# EAGLE design satshakit_micro (EAGLE 7.5.0)
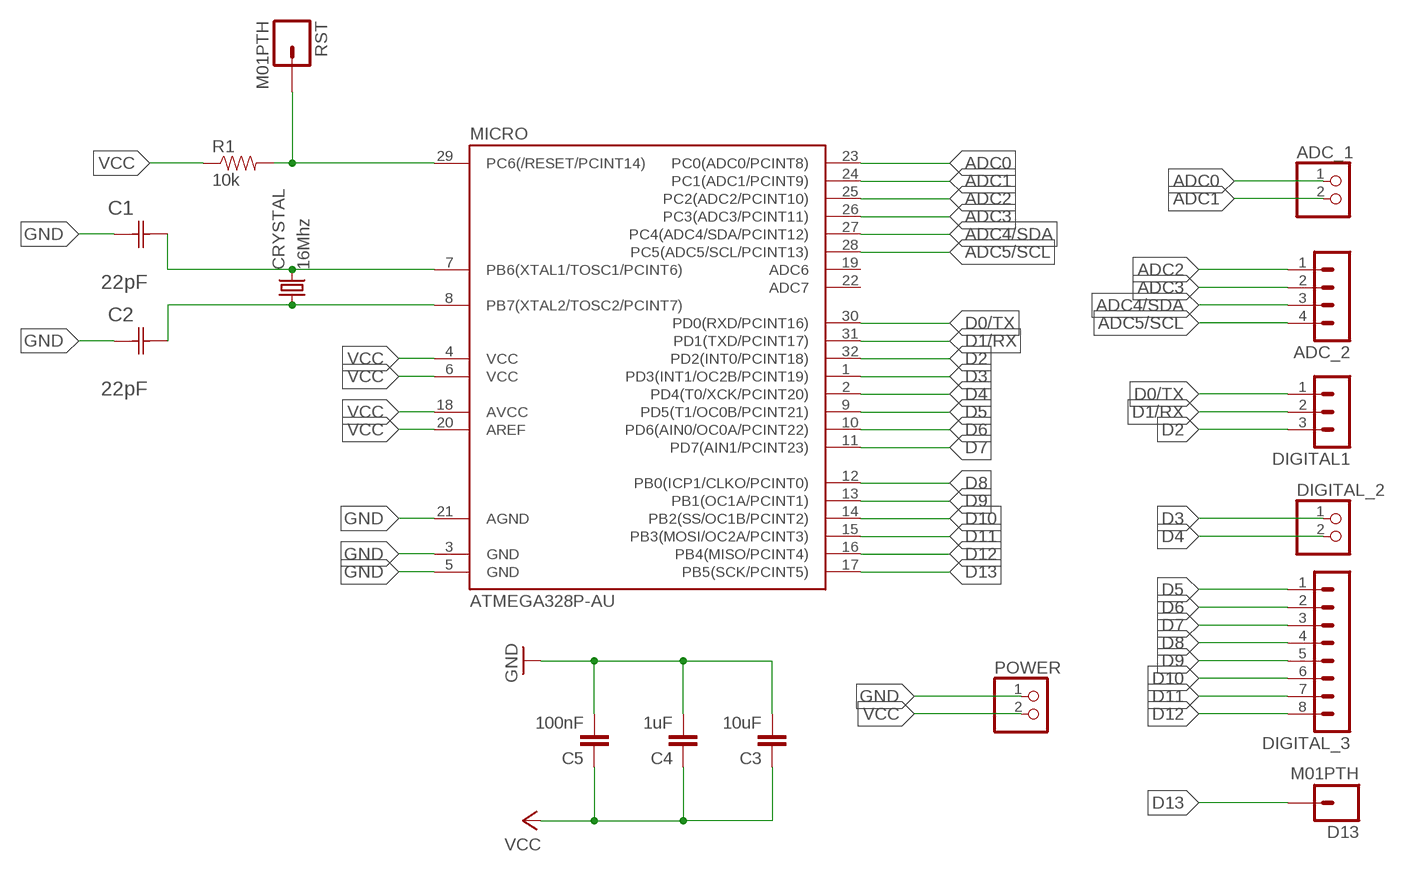
[diagram p0: schematic, sheet 1]

## Parts
ADC_1  PINHD-1X2  [1X02]
ADC_2  MA04-1  [MA04-1]
C1  22pF  0612ZC225MAT2A  [CAPC3216X178N]
C2  22pF  0612ZC225MAT2A  [CAPC3216X178N]
C3  10uF  CAP1206  [1206]
C4  1uF  CAP1206  [1206]
C5  100nF  CAP1206  [1206]
CRYSTAL  16Mhz  CSM-7X-DU  [CSM-7X-DU]
D13  M01PTH  [1X01]
DIGITAL1  MA03-1  [MA03-1]
DIGITAL_2  PINHD-1X2  [1X02]
DIGITAL_3  MA08-1  [MA08-1]
MICRO  ATMEGA328P-AU  ATMEGA48/88/168-AU  [TQFP32-08]
POWER  PINHD-1X2  [1X02]
R1  10k  RESISTOR1206  [1206]
RST  M01PTH  [1X01]

## Nets
ADC0: ADC_1.1 MICRO.23(PC0(ADC0/PCINT8))
ADC1: ADC_1.2 MICRO.24(PC1(ADC1/PCINT9))
ADC2: ADC_2.1 MICRO.25(PC2(ADC2/PCINT10))
ADC3: ADC_2.2 MICRO.26(PC3(ADC3/PCINT11))
ADC4/SDA: ADC_2.3 MICRO.27(PC4(ADC4/SDA/PCINT12))
ADC5/SCL: ADC_2.4 MICRO.28(PC5(ADC5/SCL/PCINT13))
D0/TX: DIGITAL1.1 MICRO.30(PD0(RXD/PCINT16))
D1/RX: DIGITAL1.2 MICRO.31(PD1(TXD/PCINT17))
D2: DIGITAL1.3 MICRO.32(PD2(INT0/PCINT18))
D3: DIGITAL_2.1 MICRO.1(PD3(INT1/OC2B/PCINT19))
D4: DIGITAL_2.2 MICRO.2(PD4(T0/XCK/PCINT20))
D5: DIGITAL_3.1 MICRO.9(PD5(T1/OC0B/PCINT21))
D6: DIGITAL_3.2 MICRO.10(PD6(AIN0/OC0A/PCINT22))
D7: DIGITAL_3.3 MICRO.11(PD7(AIN1/PCINT23))
D8: DIGITAL_3.4 MICRO.12(PB0(ICP1/CLKO/PCINT0))
D9: DIGITAL_3.5 MICRO.13(PB1(OC1A/PCINT1))
D10: DIGITAL_3.6 MICRO.14(PB2(SS/OC1B/PCINT2))
D11: DIGITAL_3.7 MICRO.15(PB3(MOSI/OC2A/PCINT3))
D12: DIGITAL_3.8 MICRO.16(PB4(MISO/PCINT4))
D13: D13.1 MICRO.17(PB5(SCK/PCINT5))
GND: C1.1(C1) C2.1(C1) C3.2 C4.2 C5.2 MICRO.3(GND) MICRO.5(GND) MICRO.21(AGND) POWER.1
N$2: C1.2(C2) CRYSTAL.2 MICRO.7(PB6(XTAL1/TOSC1/PCINT6))
N$3: MICRO.29(PC6(/RESET/PCINT14)) R1.2 RST.1
N$9: C2.2(C2) CRYSTAL.1 MICRO.8(PB7(XTAL2/TOSC2/PCINT7))
VCC: C3.1 C4.1 C5.1 MICRO.4(VCC) MICRO.6(VCC) MICRO.18(AVCC) MICRO.20(AREF) POWER.2 R1.1
Unconnected: MICRO.19(ADC6) MICRO.22(ADC7)

## Library data of the parts
ADC_1 DIGITAL_2 POWER = pinhead:PINHD-1X2: PIN HEADER
ADC_2 = con-lstb:MA04-1: PIN HEADER; OC_FARNELL: unknown; OC_NEWARK: unknown
C1 C2 = AVX_By_element14_Batch_1:0612ZC225MAT2A: Capacitor 1206; MPN: 0612ZC225MAT2A; OC_FARNELL: -; OC_NEWARK: 12N3209; SUPPLIER: AVX; TOLERANCE: ±20%; VALUE: 2.2µF; VOLTAGERATING: 10V
C3-C5 = 01_SparkFun:CAP: Capacitor Standard 0603 ceramic capacitor, and 0.1" leaded capacitor.
CRYSTAL = 01_FAB_Hello:CSM-7X-DU: SMD CRYSTAL Source: www.ecsxtal.com .. Crystal 3.6864MHz CSM_7X_DU.PDF; OC_FARNELL: unknown; OC_NEWARK: unknown
D13 RST = 01_SparkFun:M01: Header 1 Standard 1-pin 0.1" header. Use with straight break away headers (SKU : PRT-00116), right angle break away headers (PRT-00553), swiss pins (PRT-00743), machine pins (PRT-00117), and female headers (PRT-00115).
DIGITAL1 = con-lstb:MA03-1: PIN HEADER; OC_FARNELL: unknown; OC_NEWARK: unknown
DIGITAL_3 = con-lstb:MA08-1: PIN HEADER; OC_FARNELL: unknown; OC_NEWARK: unknown
MICRO = atmega8:ATMEGA48/88/168
R1 = 01_SparkFun:RESISTOR: Resistor Basic schematic elements and footprints for 0603, 1206, and PTH 1/10th watt (small) resistors.

## Board
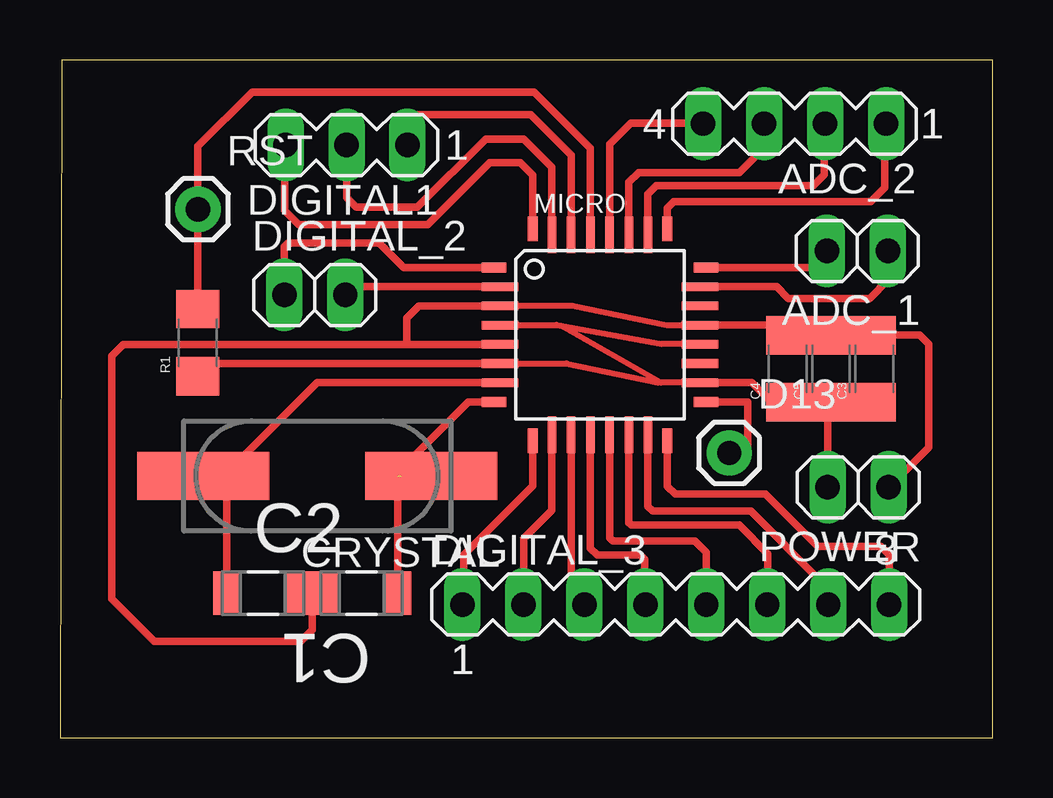
[diagram p1: board, top side]

Size 38.86 x 28.26 mm. Coordinates in mm from the lower left corner, seen from the top.
Outline: 0,0 38.86,0 38.86,28.26 0.08,28.26 0,0
Copper layers (1*16): Top 0.035mm / dielectric 1.5mm / Bottom 0.035mm
Design rules "default": minimum track width 10mil, minimum drill 24mil, track to track 8mil, track to pad 8mil, pad to pad 8mil, via to via 8mil, smd to smd 8mil, copper to edge 40mil, drill to drill 8mil, minimum pad ring 10mil, minimum via ring 8mil, stop-mask expansion 4mil, vias tented up to drill 0mil, thermal gap 10mil

### Footprints (pad centres in the part's own frame; a part is rotated, then mirrored left to right if it is on the bottom)
1X02 = drill 1.016 long: 1 -1.27,0; 2 1.27,0
MA04-1 = drill 1.016 long: 1 -3.81,0; 2 -1.27,0; 3 1.27,0; 4 3.81,0
CAPC3216X178N = smd 1.118 x 1.803: 1 -1.499,0; 2 1.499,0
1206 = smd 1.6 x 1.8: 1 -1.4,0; 2 1.4,0
CSM-7X-DU = smd 5.5 x 2: 1 -4.75,0; 2 4.75,0
1X01 = drill 1.016 pad 1.88: 1 0,0
MA03-1 = drill 1.016 long: 1 -2.54,0; 2 0,0; 3 2.54,0
MA08-1 = drill 1.016 long: 1 -8.89,0; 2 -6.35,0; 3 -3.81,0; 4 -1.27,0; 5 1.27,0; 6 3.81,0; 7 6.35,0; 8 8.89,0
TQFP32-08 = smd 1.016 x 0.406: 1 -4.42,2.8; 8 -4.42,-2.8; 17 4.42,-2.8; 24 4.42,2.8 | smd 1.524 x 0.356: 2 -4.166,2; 3 -4.166,1.2; 4 -4.166,0.4; 5 -4.166,-0.4; 6 -4.166,-1.2; 7 -4.166,-2; 18 4.166,-2; 19 4.166,-1.2; 20 4.166,-0.4; 21 4.166,0.4; 22 4.166,1.2; 23 4.166,2 | smd 0.406 x 1.016: 9 -2.8,-4.42; 16 2.8,-4.42; 25 2.8,4.42; 32 -2.8,4.42 | smd 0.356 x 1.524: 10 -2,-4.166; 11 -1.2,-4.166; 12 -0.4,-4.166; 13 0.4,-4.166; 14 1.2,-4.166; 15 2,-4.166; 26 2,4.166; 27 1.2,4.166; 28 0.4,4.166; 29 -0.4,4.166; 30 -1.2,4.166; 31 -2,4.166

### Placement (x,y rotation side)
ADC_1  33.22,20.29 180 top
ADC_2  30.61,25.6 180 top
C1  8.45,6.04 180 top
C2  12.57,6.04 0 top
C3  33.93,15.38 90 top
C4  30.32,15.38 90 top
C5  32.13,15.38 90 top
CRYSTAL  10.71,10.91 180 top
D13  27.88,11.88 0 top
DIGITAL1  11.94,24.71 180 top
DIGITAL_2  10.62,18.47 0 top
DIGITAL_3  25.66,5.56 0 top
MICRO  22.5,16.8 0 top
POWER  33.25,10.44 180 top
R1  5.74,16.47 90 top
RST  5.75,22.03 0 top

### Tracks (layer width: path | path; a pad name or v marks a point on that pad's centre or on a via)
ADC0
  Top 0.305: MICRO.23 29.86,18.8 30.35,18.31 33.73,18.31 34.49,19.08 ADC_1.1
ADC1
  Top 0.305: MICRO.24 31.95,19.61 ADC_1.2
ADC2
  Top 0.305: MICRO.25 25.3,22.07 25.58,22.35 33.78,22.35 34.37,22.94 34.37,25.55 ADC_2.1
ADC3
  Top 0.305: MICRO.26 24.5,22.67 24.84,23.01 31.39,23.01 31.85,23.47 31.85,25.58 ADC_2.2
ADC4/SDA
  Top 0.305: MICRO.27 23.7,23.17 24.11,23.57 28.3,23.57 29.34,24.61 ADC_2.3
ADC5/SCL
  Top 0.305: MICRO.28 22.9,24.75 23.77,25.63 26.77,25.63 ADC_2.4
D0/TX
  Top 0.305: MICRO.30 21.3,24.29 19.61,25.98 14.48,25.98 DIGITAL1.1
D1/RX
  Top 0.305: MICRO.31 20.5,23.8 19.33,24.97 17.73,24.97 14.88,22.12 12.34,22.12 11.94,22.53 DIGITAL1.2
D2
  Top 0.305: MICRO.32 19.7,23.46 19.18,23.98 17.91,23.98 15.32,21.39 9.96,21.39 9.37,21.97 9.37,24.69 DIGITAL1.3
D3
  Top 0.305: MICRO.1 14.33,19.61 13.31,20.62 9.5,20.62 9.35,20.47 DIGITAL_2.1
D4
  Top 0.305: MICRO.2 12.23,18.8 DIGITAL_2.2
D5
  Top 0.305: MICRO.9 19.7,10.5 16.81,7.62 16.81,5.6 DIGITAL_3.1
D6
  Top 0.305: MICRO.10 20.5,9.48 19.33,8.31 19.33,5.58 DIGITAL_3.2
D7
  Top 0.305: MICRO.11 21.3,6.11 DIGITAL_3.3
D8
  Top 0.305: MICRO.12 22.1,7.9 22.38,7.62 24.18,7.62 24.36,7.44 24.36,5.59 DIGITAL_3.4
D9
  Top 0.305: MICRO.13 22.9,8.34 23.04,8.2 26.44,8.2 26.92,7.72 DIGITAL_3.5
D10
  Top 0.305: MICRO.14 23.7,8.96 23.8,8.87 28.3,8.87 29.49,7.67 29.49,5.58 DIGITAL_3.6
D11
  Top 0.305: MICRO.15 24.5,9.64 24.69,9.45 28.78,9.45 31.73,6.5 31.73,5.84 DIGITAL_3.7
D12
  Top 0.305: MICRO.16 25.3,10.49 25.63,10.16 29.39,10.16 31.57,7.98 34.19,7.98 34.54,7.62 DIGITAL_3.8
D13
  Top 0.305: MICRO.17 28.65,14.01 28.65,11.86 27.88,11.86 D13.1
GND
  Top 0.254: MICRO.21 26.65,17.19 25.29,17.19 21.35,18.01 MICRO.3
  Top 0.305: MICRO.21 29.9,17.2 C4.2 C5.2 C3.2 35.82,16.78 36.2,16.41 36.2,12.11 POWER.1 | MICRO.5 14.48,16.41 | 14.48,16.41 2.64,16.41 2.16,15.93 2.16,5.79 3.94,4.01 10.03,4.01 10.52,4.5 10.52,5.99 | 10.52,5.99 10.49,6.02 9.95,6.02 C1.1 | 10.52,5.99 11.07,5.99 C2.1 | MICRO.3 14.96,18.01 14.45,17.5 14.45,16.43 14.48,16.41
N$2
  Top 0.254: 6.96,10.33 6.6,10.68 6.19,10.68 CRYSTAL.2
  Top 0.305: MICRO.7 10.72,14.8 6.6,10.68 | C1.2 6.96,10.33
N$3
  Top 0.305: 5.71,17.87 R1.2 5.74,22.02 RST.1 5.74,22.04 5.74,24.66 8,26.92 19.76,26.92 22.1,24.59 MICRO.29
N$9  (1 unrouted)
  Top 0.305: MICRO.8 17.01,14.01 13.88,10.87 13.88,10.91 14.21,10.91 CRYSTAL.1 | C2.2 14.07,10.91
VCC
  Top 0.254: MICRO.20 26.05,16.41 26.05,16.42 25.09,16.42 20.86,17.18 | MICRO.4 20.68,17.21 20.86,17.18 | MICRO.6 | 19.02,15.61 21.1,15.61 24.91,14.81 24.91,14.8 MICRO.18 | 26.67,14.81 MICRO.18 25.04,14.81 20.86,17.18
  Top 0.305: MICRO.18 | MICRO.20 26.05,16.42 | 26.66,14.77 MICRO.18 | 19.02,15.61 MICRO.6 | MICRO.6 5.74,15.61 R1.1 | C5.1 C4.1 30.36,13.95 30.94,13.95 30.91,13.97 29.66,13.97 28.82,14.81 26.67,14.81 MICRO.18 | POWER.2 31.98,13.84 C5.1 | C5.1 C3.1